# Altium schematic sheet Sheet1.SchDoc
size A4
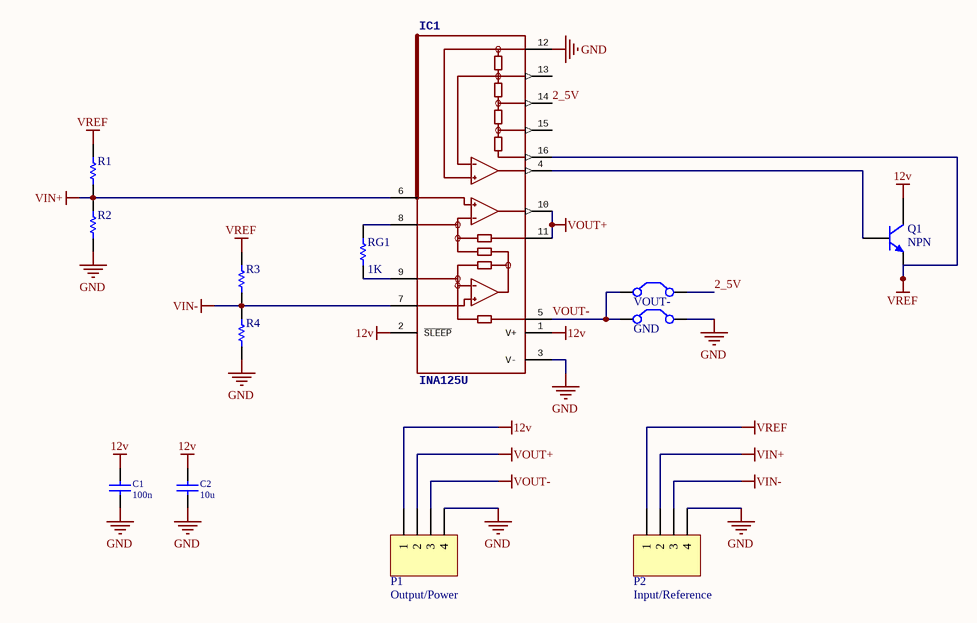
[diagram p0: Sheet1.SchDoc]

## Parts
C1  100n  [C1206]
C2  10u  [SMD CAPACITOR 220UF 16V]
IC1  INA125U  [SOIC16_M]
P1  Output/Power  [SMD 4Wire]
P2  Input/Reference  [SMD 4Wire]
Q1  NPN  [TO220_SMD_BENT]
R1  Res1  [R0805]  (value not drawn)
R2  Res1  [R0805]  (value not drawn)
R3  Res1  [R0805]  (value not drawn)
R4  Res1  [R0805]  (value not drawn)
RG1  value 1K  [R0805]  (hidden comment: Res1)
W5  VOUT-  [R0805]
W6  GND  [R0805]

## Nets
12v: C1.1 C2.1 IC1.1(V+) IC1.2(~{SLEEP}) P1.1 Q1.2(C)
GND: C1.2 C2.2 IC1.3(V-) IC1.12(REFCOM) P1.4 P2.4 R2.1 R4.1 W6.2(C2)
VIN+: IC1.6(+IN) P2.2 R1.1 R2.2
VIN-: IC1.7(-IN) P2.3 R3.1 R4.2
VOUT+: IC1.10(OUT) IC1.11(SENSE) P1.2
VOUT-: IC1.5(REF) P1.3 W5.1(C1) W6.1(C1)
VREF: IC1.16(REF10) P2.1 Q1.1(E) R1.2 R3.2
2_5V: IC1.14(REF2.5) W5.2(C2)
NetIC1_4: IC1.4(REFOUT) Q1.3(B)
NetIC1_8: IC1.8(RG) RG1.2
NetIC1_9: IC1.9(RG) RG1.1

Not connected (* = marked no-connect by the designer): IC1 13(REFBG) 15(REF5)

## Library data of the parts
C1 C2 = CAP_1: Capacitor; Supplier: FARNELL; Supplier Code: 317-287
IC1 = INA125U: <b>Instrumentation Amplifier</b><p> / with Precision Voltage Reference; MF: TEXAS INSTRUMENT CONNECTORS; MPN: INA125U; OC_FARNELL: 1304375; OC_NEWARK: 80K5901
P1 P2 = Header 4: Header, 4-Pin; LatestRevisionDate: 17-Jul-2002; LatestRevisionNote: Re-released for DXP Platform.; Publisher: Altium Limited
Q1 = NPN: NPN Bipolar Transistor; Published: 8-Jun-2000; LatestRevisionDate: 17-Jul-2002; LatestRevisionNote: Re-released for DXP Platform.; PackageReference: TO-226-AA; Publisher: Altium Limited; PackageDescription: TO, Flat Index; 3 In-Line, Axial Leads; Body Dia. 4.8mm; Leads 0.55 x 0.51 mm (max); Code_JEDEC: TO-226-AA
R1-R4 RG1 = Res1: Resistor; Published: 8-Jun-2000; LatestRevisionDate: 17-Jul-2002; LatestRevisionNote: Re-released for DXP Platform.; PackageReference: AXIAL-0.3; Publisher: Altium Limited; PackageDescription: Axial Device, Thru-Hole; 2 Leads; 0.3 in Pin Spacing
W5 W6 = Jumper: Jumper Wire; Published: 24-Mar-1999; LatestRevisionDate: 17-Jul-2002; LatestRevisionNote: Re-released for DXP Platform.; PackageReference: RAD-0.2; Publisher: Altium Limited; PackageDescription: Radial Cap, Thru-Hole; 2 Leads; 0.2 in Pin Spacing